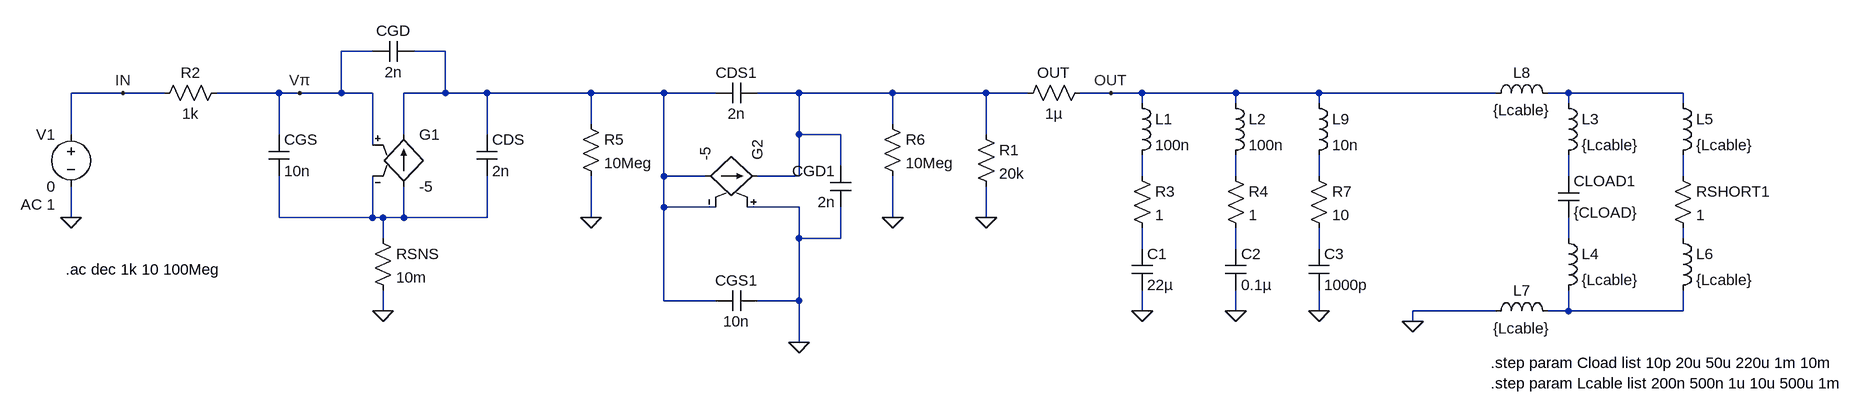
[diagram p0: schematic Simple_Small_Signal_Model.asc]
Simple_Small_Signal_Model.asc, the LTspice schematic file:
Version 4.1
SHEET 1 1288 796
WIRE -1024 0 -1072 0
WIRE -912 0 -960 0
WIRE -1408 64 -1488 64
WIRE -1344 64 -1408 64
WIRE -1168 64 -1264 64
WIRE -1136 64 -1168 64
WIRE -1072 64 -1072 0
WIRE -1072 64 -1136 64
WIRE -1024 64 -1072 64
WIRE -912 64 -912 0
WIRE -912 64 -976 64
WIRE -848 64 -912 64
WIRE -688 64 -848 64
WIRE -576 64 -688 64
WIRE -496 64 -576 64
WIRE -368 64 -432 64
WIRE -224 64 -368 64
WIRE -80 64 -224 64
WIRE -16 64 -80 64
WIRE 112 64 64 64
WIRE 160 64 112 64
WIRE 304 64 160 64
WIRE 432 64 304 64
WIRE 704 64 432 64
WIRE 816 64 784 64
WIRE 992 64 816 64
WIRE 160 80 160 64
WIRE 304 80 304 64
WIRE 432 80 432 64
WIRE 816 80 816 64
WIRE 992 80 992 64
WIRE -688 112 -688 64
WIRE -224 112 -224 64
WIRE -1488 128 -1488 64
WIRE -1168 128 -1168 64
WIRE -976 128 -976 64
WIRE -848 128 -848 64
WIRE -368 128 -368 64
WIRE -304 128 -368 128
WIRE -80 128 -80 64
WIRE -1024 144 -1024 64
WIRE -304 176 -304 128
WIRE -576 192 -576 64
WIRE -512 192 -576 192
WIRE -368 192 -368 128
WIRE -368 192 -432 192
WIRE 160 192 160 160
WIRE 304 192 304 160
WIRE 432 192 432 160
WIRE 816 192 816 160
WIRE 992 192 992 160
WIRE -576 240 -576 192
WIRE -496 240 -576 240
WIRE -368 240 -448 240
WIRE -1488 256 -1488 208
WIRE -1168 256 -1168 192
WIRE -1024 256 -1024 192
WIRE -1024 256 -1168 256
WIRE -1008 256 -1024 256
WIRE -976 256 -976 208
WIRE -976 256 -1008 256
WIRE -848 256 -848 192
WIRE -848 256 -976 256
WIRE -688 256 -688 192
WIRE -224 256 -224 192
WIRE -80 256 -80 208
WIRE -1008 288 -1008 256
WIRE -368 288 -368 240
WIRE -304 288 -304 240
WIRE -304 288 -368 288
WIRE 816 288 816 256
WIRE 992 288 992 272
WIRE 160 304 160 272
WIRE 304 304 304 272
WIRE 432 304 432 272
WIRE -576 384 -576 240
WIRE -496 384 -576 384
WIRE -368 384 -368 288
WIRE -368 384 -432 384
WIRE -1008 400 -1008 368
WIRE 160 400 160 368
WIRE 304 400 304 368
WIRE 432 400 432 368
WIRE 704 400 576 400
WIRE 816 400 816 368
WIRE 816 400 784 400
WIRE 992 400 992 368
WIRE 992 400 816 400
WIRE 576 416 576 400
WIRE -368 448 -368 384
FLAG -1488 256 0
FLAG -80 256 0
FLAG -1136 64 Vπ
FLAG -1408 64 IN
FLAG -1008 400 0
FLAG 576 416 0
FLAG 160 400 0
FLAG 304 400 0
FLAG -368 448 0
FLAG -688 256 0
FLAG -224 256 0
FLAG 432 400 0
FLAG 112 64 OUT
SYMBOL g -976 112 R0
SYMATTR InstName G1
SYMATTR Value -5
SYMBOL voltage -1488 112 M0
WINDOW 123 24 124 Left 2
WINDOW 39 0 0 Left 0
SYMATTR Value2 AC 1
SYMATTR InstName V1
SYMATTR Value 0
SYMBOL res -96 112 R0
SYMATTR InstName R1
SYMATTR Value 20k
SYMBOL res -1248 48 R90
WINDOW 0 0 56 VBottom 2
WINDOW 3 32 56 VTop 2
SYMATTR InstName R2
SYMATTR Value 1k
SYMBOL cap -1184 128 R0
SYMATTR InstName CGS
SYMATTR Value 10n
SYMBOL cap -960 -16 R90
WINDOW 0 0 32 VBottom 2
WINDOW 3 32 32 VTop 2
SYMATTR InstName CGD
SYMATTR Value 2n
SYMBOL res 80 48 R90
WINDOW 0 0 56 VBottom 2
WINDOW 3 32 56 VTop 2
SYMATTR InstName OUT
SYMATTR Value 1µ
SYMBOL cap -864 128 R0
SYMATTR InstName CDS
SYMATTR Value 2n
SYMBOL res -1024 272 R0
SYMATTR InstName RSNS
SYMATTR Value 10m
SYMBOL ind 800 64 R0
SYMATTR InstName L3
SYMATTR Value {Lcable}
SYMBOL cap 800 192 R0
SYMATTR InstName CLOAD1
SYMATTR Value {CLOAD}
SYMBOL ind 800 272 R0
SYMATTR InstName L4
SYMATTR Value {Lcable}
SYMBOL ind 976 64 R0
SYMATTR InstName L5
SYMATTR Value {Lcable}
SYMBOL ind 976 272 R0
SYMATTR InstName L6
SYMATTR Value {Lcable}
SYMBOL res 976 176 R0
SYMATTR InstName RSHORT1
SYMATTR Value 1
SYMBOL ind 688 416 R270
WINDOW 0 32 56 VTop 2
WINDOW 3 5 56 VBottom 2
SYMATTR InstName L7
SYMATTR Value {Lcable}
SYMBOL ind 688 80 R270
WINDOW 0 32 56 VTop 2
WINDOW 3 5 56 VBottom 2
SYMATTR InstName L8
SYMATTR Value {Lcable}
SYMBOL ind 144 64 R0
SYMATTR InstName L1
SYMATTR Value 100n
SYMBOL res 144 176 R0
SYMATTR InstName R3
SYMATTR Value 1
SYMBOL cap 144 304 R0
SYMATTR InstName C1
SYMATTR Value 22µ
SYMBOL ind 288 64 R0
SYMATTR InstName L2
SYMATTR Value 100n
SYMBOL res 288 176 R0
SYMATTR InstName R4
SYMATTR Value 1
SYMBOL cap 288 304 R0
SYMATTR InstName C2
SYMATTR Value 0.1µ
SYMBOL g -416 192 M270
SYMATTR InstName G2
SYMATTR Value -5
SYMBOL cap -432 400 M270
WINDOW 0 32 32 VTop 2
WINDOW 3 0 32 VBottom 2
SYMATTR InstName CGS1
SYMATTR Value 10n
SYMBOL cap -288 176 M0
SYMATTR InstName CGD1
SYMATTR Value 2n
SYMBOL cap -432 80 M270
WINDOW 0 32 32 VTop 2
WINDOW 3 0 32 VBottom 2
SYMATTR InstName CDS1
SYMATTR Value 2n
SYMBOL res -704 96 R0
SYMATTR InstName R5
SYMATTR Value 10Meg
SYMBOL res -240 96 R0
SYMATTR InstName R6
SYMATTR Value 10Meg
SYMBOL ind 416 64 R0
SYMATTR InstName L9
SYMATTR Value 10n
SYMBOL res 416 176 R0
SYMATTR InstName R7
SYMATTR Value 10
SYMBOL cap 416 304 R0
SYMATTR InstName C3
SYMATTR Value 1000p
TEXT -1496 336 Left 2 !.ac dec 1k 10 100Meg
TEXT 696 480 Left 2 !.step param Cload list 10p 20u 50u 220u 1m 10m\n.step param Lcable list 200n 500n 1u 10u 500u 1m

The netlist it stands for:
* Simple_Small_Signal_Model.asc
G1 N009 N001 Vπ N009 -5
V1 IN 0 0 AC 1
R1 N002 0 20k
R2 Vπ IN 1k
CGS Vπ N009 10n
CGD N001 Vπ 2n
R§OUT OUT N002 1µ
CDS N001 N009 2n
RSNS N009 0 10m
L3 N003 N007 {Lcable}
CLOAD1 N007 N010 {CLOAD}
L4 N010 N015 {Lcable}
L5 N003 N008 {Lcable}
L6 N011 N015 {Lcable}
RSHORT1 N008 N011 1
L7 0 N015 {Lcable}
L8 OUT N003 {Lcable}
L1 OUT N004 100n
R3 N004 N012 1
C1 N012 0 22µ
L2 OUT N005 100n
R4 N005 N013 1
C2 N013 0 0.1µ
G2 N001 N002 0 N001 -5
CGS1 0 N001 10n
CGD1 N002 0 2n
CDS1 N002 N001 2n
R5 N001 0 10Meg
R6 N002 0 10Meg
L9 OUT N006 10n
R7 N006 N014 10
C3 N014 0 1000p
.ac dec 1k 10 100Meg
.step param Cload list 10p 20u 50u 220u 1m 10m
.step param Lcable list 200n 500n 1u 10u 500u 1m
.backanno
.end